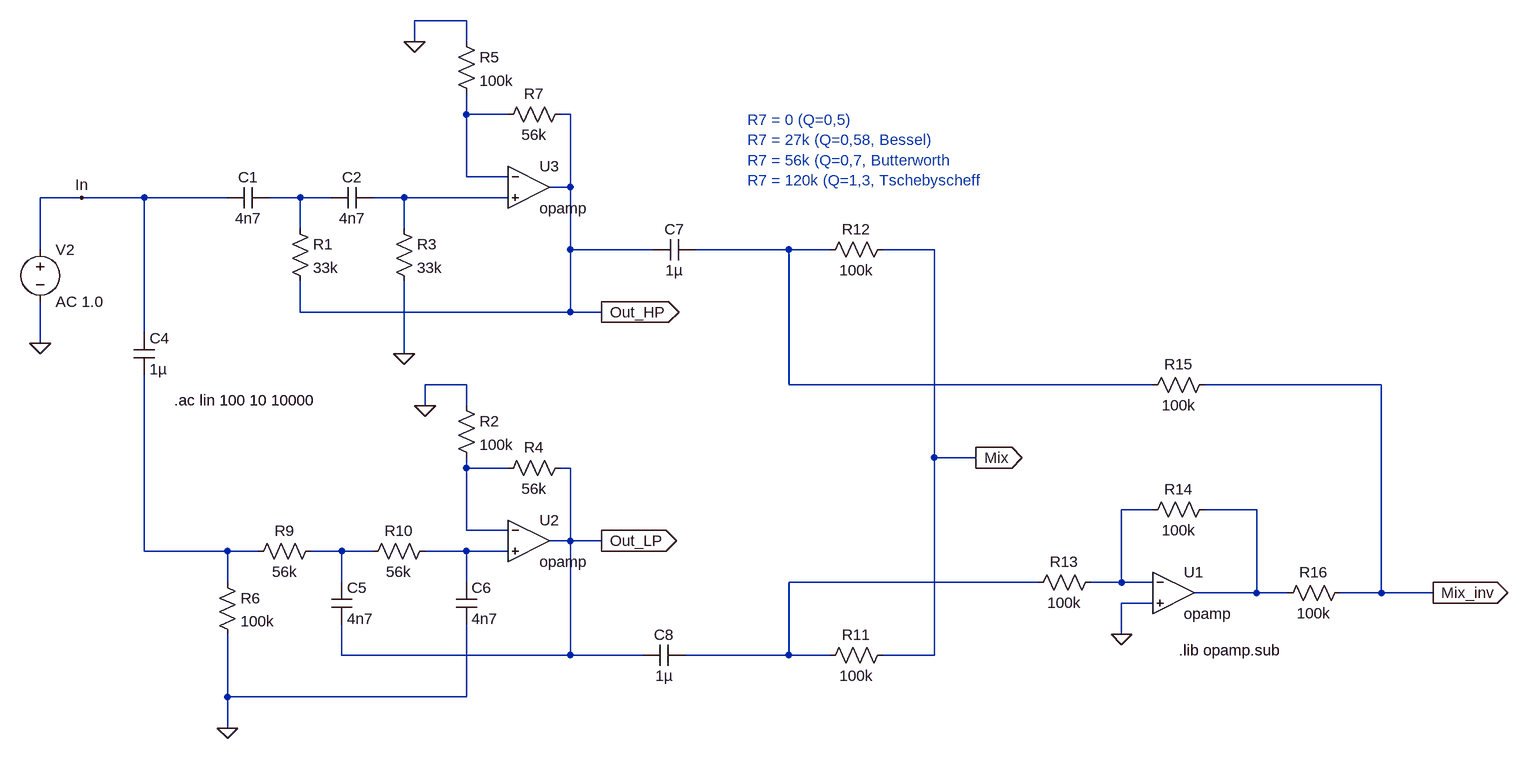
[diagram p0: schematic sallen-key_fw_opamp_norm.asc]
sallen-key_fw_opamp_norm.asc, the LTspice schematic file:
Version 4
SHEET 1 2056 1012
WIRE 416 -160 336 -160
WIRE 336 -128 336 -160
WIRE 416 -128 416 -160
WIRE 416 -16 416 -48
WIRE 480 -16 416 -16
WIRE 576 -16 560 -16
WIRE 416 80 416 -16
WIRE 480 80 416 80
WIRE 576 96 576 -16
WIRE 576 96 544 96
WIRE -176 112 -240 112
WIRE -80 112 -176 112
WIRE 48 112 -80 112
WIRE 160 112 112 112
WIRE 208 112 160 112
WIRE 320 112 272 112
WIRE 480 112 320 112
WIRE 160 160 160 112
WIRE 320 160 320 112
WIRE -240 192 -240 112
WIRE 576 192 576 96
WIRE 704 192 576 192
WIRE 912 192 768 192
WIRE 976 192 912 192
WIRE 1136 192 1056 192
WIRE 160 288 160 240
WIRE 576 288 576 192
WIRE 576 288 160 288
WIRE 624 288 576 288
WIRE -80 320 -80 112
WIRE -240 336 -240 272
WIRE 320 352 320 240
WIRE 416 400 352 400
WIRE 912 400 912 192
WIRE 1472 400 912 400
WIRE 1824 400 1552 400
WIRE 352 432 352 400
WIRE 416 432 416 400
WIRE 1136 512 1136 192
WIRE 1200 512 1136 512
WIRE 416 528 416 512
WIRE 480 528 416 528
WIRE 576 528 560 528
WIRE 1472 592 1424 592
WIRE 1632 592 1552 592
WIRE 416 624 416 528
WIRE 480 624 416 624
WIRE 576 640 576 528
WIRE 576 640 544 640
WIRE 624 640 576 640
WIRE -80 656 -80 384
WIRE 48 656 -80 656
WIRE 96 656 48 656
WIRE 224 656 176 656
WIRE 272 656 224 656
WIRE 416 656 352 656
WIRE 480 656 416 656
WIRE 48 704 48 656
WIRE 224 704 224 656
WIRE 416 704 416 656
WIRE 1296 704 912 704
WIRE 1424 704 1424 592
WIRE 1424 704 1376 704
WIRE 1472 704 1424 704
WIRE 1632 720 1632 592
WIRE 1632 720 1536 720
WIRE 1680 720 1632 720
WIRE 1824 720 1824 400
WIRE 1824 720 1760 720
WIRE 1904 720 1824 720
WIRE 1472 736 1424 736
WIRE 1424 784 1424 736
WIRE 224 816 224 768
WIRE 576 816 576 640
WIRE 576 816 224 816
WIRE 688 816 576 816
WIRE 912 816 912 704
WIRE 912 816 752 816
WIRE 976 816 912 816
WIRE 1136 816 1136 512
WIRE 1136 816 1056 816
WIRE 48 880 48 784
WIRE 416 880 416 768
WIRE 416 880 48 880
WIRE 48 928 48 880
FLAG 320 352 0
FLAG 624 288 Out_HP
IOPIN 624 288 Out
FLAG -176 112 In
FLAG -240 336 0
FLAG 48 928 0
FLAG 624 640 Out_LP
IOPIN 624 640 Out
FLAG 1200 512 Mix
IOPIN 1200 512 Out
FLAG 1424 784 0
FLAG 1904 720 Mix_inv
IOPIN 1904 720 Out
FLAG 336 -128 0
FLAG 352 432 0
SYMBOL cap 272 96 R90
WINDOW 0 0 32 VBottom 2
WINDOW 3 32 32 VTop 2
SYMATTR InstName C2
SYMATTR Value 4n7
SYMBOL res 304 144 R0
SYMATTR InstName R3
SYMATTR Value 33k
SYMBOL voltage -240 176 R0
SYMATTR InstName V2
SYMATTR Value AC 1.0
SYMBOL res 32 688 R0
SYMATTR InstName R6
SYMATTR Value 100k
SYMBOL cap -96 320 R0
SYMATTR InstName C4
SYMATTR Value 1µ
SYMBOL res 192 640 R90
WINDOW 0 0 56 VBottom 2
WINDOW 3 32 56 VTop 2
SYMATTR InstName R9
SYMATTR Value 56k
SYMBOL res 368 640 R90
WINDOW 0 0 56 VBottom 2
WINDOW 3 32 56 VTop 2
SYMATTR InstName R10
SYMATTR Value 56k
SYMBOL cap 208 704 R0
SYMATTR InstName C5
SYMATTR Value 4n7
SYMBOL cap 400 704 R0
SYMATTR InstName C6
SYMATTR Value 4n7
SYMBOL cap 112 96 R90
WINDOW 0 0 32 VBottom 2
WINDOW 3 32 32 VTop 2
SYMATTR InstName C1
SYMATTR Value 4n7
SYMBOL res 144 144 R0
SYMATTR InstName R1
SYMATTR Value 33k
SYMBOL res 1072 800 R90
WINDOW 0 0 56 VBottom 2
WINDOW 3 32 56 VTop 2
SYMATTR InstName R11
SYMATTR Value 100k
SYMBOL res 1072 176 R90
WINDOW 0 0 56 VBottom 2
WINDOW 3 32 56 VTop 2
SYMATTR InstName R12
SYMATTR Value 100k
SYMBOL res 1392 688 R90
WINDOW 0 0 56 VBottom 2
WINDOW 3 32 56 VTop 2
SYMATTR InstName R13
SYMATTR Value 100k
SYMBOL res 1568 576 R90
WINDOW 0 0 56 VBottom 2
WINDOW 3 32 56 VTop 2
SYMATTR InstName R14
SYMATTR Value 100k
SYMBOL res 1568 384 R90
WINDOW 0 0 56 VBottom 2
WINDOW 3 32 56 VTop 2
SYMATTR InstName R15
SYMATTR Value 100k
SYMBOL res 1776 704 R90
WINDOW 0 0 56 VBottom 2
WINDOW 3 32 56 VTop 2
SYMATTR InstName R16
SYMATTR Value 100k
SYMBOL Opamps\\opamp 1504 656 R0
SYMATTR InstName U1
SYMBOL cap 768 176 R90
WINDOW 0 0 32 VBottom 2
WINDOW 3 32 32 VTop 2
SYMATTR InstName C7
SYMATTR Value 1µ
SYMBOL cap 752 800 R90
WINDOW 0 0 32 VBottom 2
WINDOW 3 32 32 VTop 2
SYMATTR InstName C8
SYMATTR Value 1µ
SYMBOL Opamps\\opamp 512 576 R0
SYMATTR InstName U2
SYMBOL Opamps\\opamp 512 32 R0
SYMATTR InstName U3
SYMBOL res 400 416 R0
SYMATTR InstName R2
SYMATTR Value 100k
SYMBOL res 576 512 R90
WINDOW 0 0 56 VBottom 2
WINDOW 3 32 56 VTop 2
SYMATTR InstName R4
SYMATTR Value 56k
SYMBOL res 400 -144 R0
SYMATTR InstName R5
SYMATTR Value 100k
SYMBOL res 576 -32 R90
WINDOW 0 0 56 VBottom 2
WINDOW 3 32 56 VTop 2
SYMATTR InstName R7
SYMATTR Value 56k
TEXT -34 424 Left 2 !.ac lin 100 10 10000
TEXT 1512 808 Left 2 !.lib opamp.sub
TEXT 848 -8 Left 2 ;R7 = 0 (Q=0,5)\nR7 = 27k (Q=0,58, Bessel)\nR7 = 56k (Q=0,7, Butterworth\nR7 = 120k (Q=1,3, Tschebyscheff

The netlist it stands for:
* sallen-key_fw_opamp_norm.asc
C2 N003 N002 4n7
R3 N003 0 33k
V2 In 0 AC 1.0
R6 N008 0 100k
C4 In N008 1µ
R9 N009 N008 56k
R10 N010 N009 56k
C5 N009 Out_LP 4n7
C6 N010 0 4n7
C1 N002 In 4n7
R1 N002 Out_HP 33k
R11 Mix N011 100k
R12 Mix N004 100k
R13 N006 N011 100k
R14 N007 N006 100k
R15 Mix_inv N004 100k
R16 Mix_inv N007 100k
XU1 N006 0 N007 opamp Aol=100K GBW=10Meg  ; pins invin noninvin out
C7 N004 Out_HP 1µ
C8 N011 Out_LP 1µ
XU2 N005 N010 Out_LP opamp Aol=100K GBW=10Meg  ; pins invin noninvin out
XU3 N001 N003 Out_HP opamp Aol=100K GBW=10Meg  ; pins invin noninvin out
R2 0 N005 100k
R4 Out_LP N005 56k
R5 0 N001 100k
R7 Out_HP N001 56k
.ac lin 100 10 10000
.lib opamp.sub
* R7 = 0 (Q=0,5)
* R7 = 27k (Q=0,58, Bessel)
* R7 = 56k (Q=0,7, Butterworth
* R7 = 120k (Q=1,3, Tschebyscheff
.backanno
.end